# EAGLE design Qwiic_KX134 (EAGLE 9.6.2)
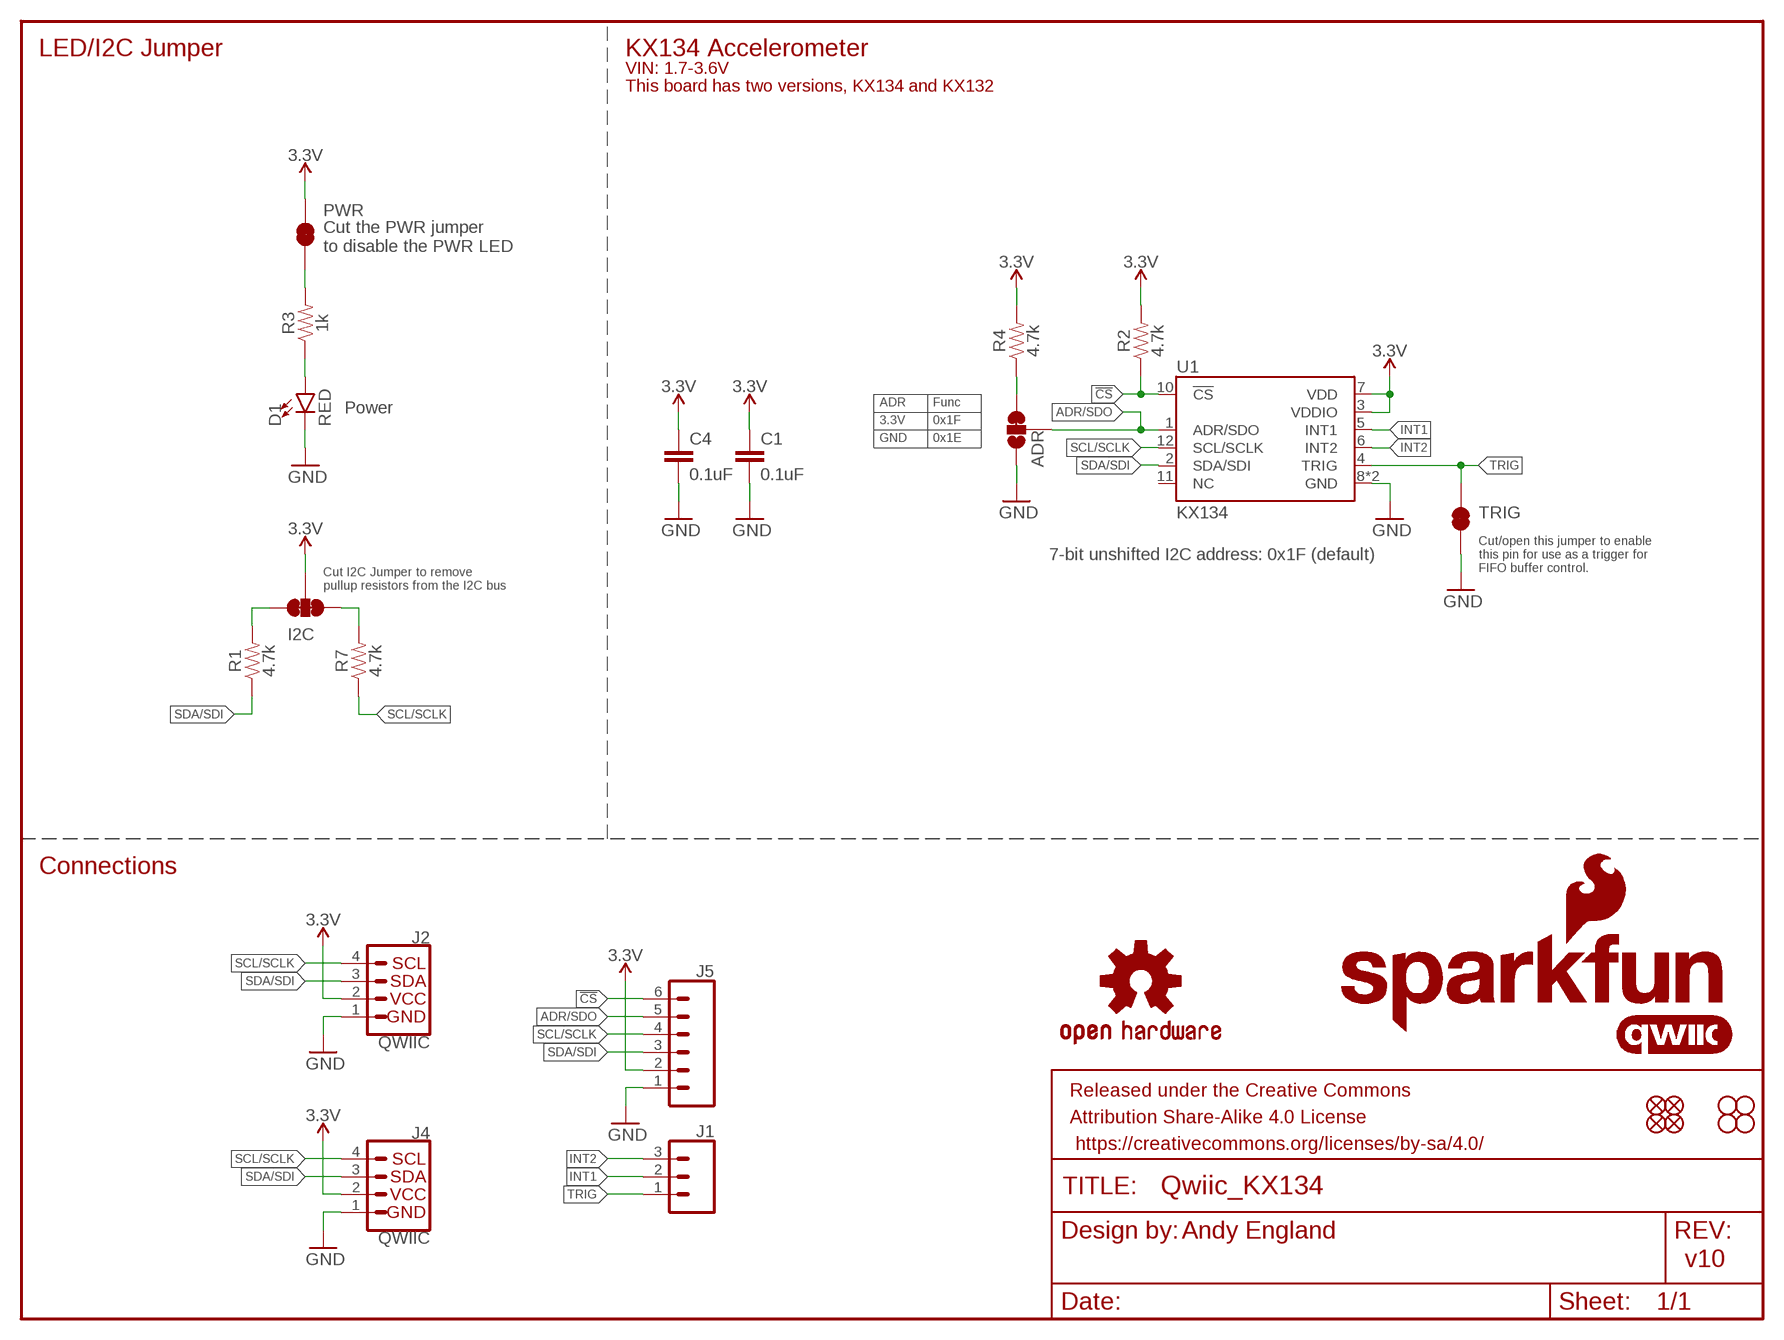
[diagram p0: schematic, sheet 1]

## Parts
ADR  JUMPER-SMT_3_1-NC_TRACE_SILK  [SMT-JUMPER_3_1-NC_TRACE_SILK]
C1  0.1uF  0.1UF-0603-25V-(+80/-20%)  [0603]
C4  0.1uF  0.1UF-0603-25V-(+80/-20%)  [0603]
D1  RED  LED-RED0603  [LED-0603]
FRAME1  FRAME-LETTER  [CREATIVE_COMMONS]
I2C  JUMPER-SMT_3_2-NC_TRACE_SILK  [SMT-JUMPER_3_2-NC_TRACE_SILK]
J1  CONN_031X03_NO_SILK  [1X03_NO_SILK]
J2  QWIIC  QWIIC_CONNECTORJS-1MM  [JST04_1MM_RA]
J4  QWIIC  QWIIC_CONNECTORJS-1MM  [JST04_1MM_RA]
J5  CONN_06NO_SILK_NO_POP  [1X06_NO_SILK]
JP1  FIDUCIALUFIDUCIAL  [MICRO-FIDUCIAL]
JP2  FIDUCIALUFIDUCIAL  [MICRO-FIDUCIAL]
JP3  STAND-OFF  [STAND-OFF]
JP4  STAND-OFF  [STAND-OFF]
JP5  FIDUCIALUFIDUCIAL  [MICRO-FIDUCIAL]
JP6  FIDUCIALUFIDUCIAL  [MICRO-FIDUCIAL]
JP7  STAND-OFF  [STAND-OFF]
JP8  STAND-OFF  [STAND-OFF]
LOGO1  SFE_LOGO_FLAME.1_INCH  [SFE_LOGO_FLAME_.1]
LOGO2  SFE_LOGO_FLAME.1_INCH  [SFE_LOGO_FLAME_.1]
LOGO3  QWIIC_LOGO_4MM  [QWIIC_4MM]
LOGO4  SFE_LOGO_NAME_FLAME.1_INCH  [SFE_LOGO_NAME_FLAME_.1]
LOGO5  OSHW-LOGOS  [OSHW-LOGO-S]
PWR  JUMPER-SMT_2_NC_TRACE_SILK  [SMT-JUMPER_2_NC_TRACE_SILK]
R1  4.7k  4.7KOHM-0603-1/10W-1%  [0603]
R2  4.7k  4.7KOHM-0603-1/10W-1%  [0603]
R3  1k  1KOHM-0603-1/10W-1%  [0603]
R4  4.7k  4.7KOHM-0603-1/10W-1%  [0603]
R7  4.7k  4.7KOHM-0603-1/10W-1%  [0603]
TRIG  JUMPER-SMT_2_NC_TRACE_SILK  [SMT-JUMPER_2_NC_TRACE_SILK]
U1  KX134  KX13X-KX134  [KX13X]

## Nets
3.3V: C1.1 C4.1 I2C.2 J2.2 J4.2 J5.2 PWR.2 R2.2 R4.2 U1.3(VDDIO) U1.7(VDD)
!CS: J5.6 R2.1 U1.10(!CS)
ADR/SDO: ADR.2 J5.5 U1.1(ADR/SDO)
GND: ADR.1 C1.2 C4.2 D1.C J2.1 J4.1 J5.1 TRIG.2 U1.8(GND) U1.9(GND)
INT1: J1.2 U1.5(INT1)
INT2: J1.3 U1.6(INT2)
N$1: PWR.1 R3.2
N$2: I2C.3 R1.2
N$3: D1.A R3.1
N$4: I2C.1 R7.2
N$5: ADR.3 R4.1
SCL/SCLK: J2.4 J4.4 J5.4 R7.1 U1.12(SCL/SCLK)
SDA/SDI: J2.3 J4.3 J5.3 R1.1 U1.2(SDA/SDI)
TRIG: J1.1 TRIG.1 U1.4(TRIG)
Unconnected: U1.11(NC)

## Notes on the sheet
- LED/I2C Jumper | KX134 Accelerometer
- VIN: 1.7-3.6V
- This board has two versions, KX134 and KX132
- Cut the PWR jumper 
  to disable the PWR LED
- ADR | Func
- Power
- 3.3V | 0x1F
- GND | 0x1E
- 7-bit unshifted I2C address: 0x1F (default)
- Cut/open this jumper to enable 
  this pin for use as a trigger for
  FIFO buffer control.
- Cut I2C Jumper to remove 
  pullup resistors from the I2C bus
- Connections
- Andy England
- v10

## Library data of the parts
ADR = SparkFun-Jumpers:JUMPER-SMT_3_1-NC_TRACE: Normally closed trace jumper (1 of 2 connections) This jumper has a trace between two pads so it's normally closed (NC). The other connection is normally open (NO). Use a razor knife to open the connection. For best results follow the IPC guidelines for cutting traces: Cutout at least 0.063 mm (0.005 in). Remove all loose material to clean up the cut area. Seal the cut with an approved epoxy. Reapply solder to reclose the connection, or to close the NO connection.
C1 C4 = SparkFun-Capacitors:0.1UF: 0.1µF ceramic capacitors A capacitor is a passive two-terminal electrical component used to store electrical energy temporarily in an electric field.; PROD_ID: CAP-00810
D1 = SparkFun-LED:LED-RED: Red SMD LED Used in manufacturing of most products at SparkFun Packages: 0603 - SMD 0603 package [Product Link] <http://docs.avagotech.com/docs/AV02-0551EN> 0603 SMART - SMD 0603 SMART package ( more efficient and expensive)[Product Link] <http://www.osram-os.com/Graphics/XPic2/00077099_0.pdf> 1206 - SMD1206 package [Product Link] <https://www.sparkfun.com/datasheets/DevTools/LilyPad/Q150OVS4.pdff> SparkFun Products: Pro Mini 328 -5V <https://www.sparkfun.com/products/821> RedBoard <https://www.sparkfun.com/products/12757> IOIO-OTG <https://www.sparkfun.com/products/13613>; PROD_ID: DIO-00819
FRAME1 = SparkFun-Aesthetics:FRAME-LETTER: Schematic Frame - Letter Standard 8.5x11 US Letter frame
I2C = SparkFun-Jumpers:JUMPER-SMT_3_2-NC_TRACE: Normally closed trace jumper (2 of 2 connections) This jumper has a trace between all three pads so they are normally closed (NC). Use a razor knife to open the connection(s). For best results follow the IPC guidelines for cutting traces: Cutout at least 0.063 mm (0.005 in). Remove all loose material to clean up the cut area. Seal the cut with an approved epoxy. Reapply solder to reclose the connection(s).
J1 = SparkFun-Connectors:CONN_03: Multi connection point. Often used as Generic Header-pin footprint for 0.1 inch spaced/style header connections On any of the 0.1 inch spaced packages, you can populate with these: Break Away Headers - Straight <https://www.sparkfun.com/products/116> (PRT-00116) Break Away Male Headers - Right Angle <https://www.sparkfun.com/products/553> (PRT-00553) Female Headers <https://www.sparkfun.com/products/115> (PRT-00115) Break Away Headers - Machine Pin <https://www.sparkfun.com/products/117> (PRT-00117) Break Away Female Headers - Swiss Machine Pin <https://www.sparkfun.com/products/743> (PRT-00743) Stackable Header - 3 Pin (Female, 0.1") <https://www.sparkfun.com/products/13875> (PRT-13875) For SCREWTERMINALS and SPRING TERMINALS visit here: Screw Terimnals on SparkFun.com <https://www.sparkfun.com/search/results?term=Screw+Terminals> (5mm/3.5mm/2.54mm spacing) This device is also useful as a general connection point to wire up your design to another part of your project. Our various solder wires solder well into these plated through hole pads. Hook-Up Wire - Assortment (Stranded, 22 AWG) <https://www.sparkfun.com/products/11375> (PRT-11375) Hook-Up Wire - Assortment (Solid Core, 22 AWG) <https://www.sparkfun.com/products/11367> (PRT-11367) View the entire wire category on our website here <https://www.sparkfun.com/categories/141> Special notes: Molex polarized connector foot print use with SKU : PRT-08232 with associated crimp pins and housings.
J2 J4 = SparkFun-Connectors:QWIIC_CONNECTOR: SparkFun I2C Standard Qwiic Connector An SMD 1mm pitch JST connector makes it easy and quick (get it? Qwiic?) to connect I2C devices to each other. The Qwiic system <http://www.sparkfun.com/qwiic> enables fast and solderless connection between popular platforms and various sensors and actuators. We carry 200mm <https://www.sparkfun.com/products/14204>, 100mm <https://www.sparkfun.com/products/14205>, 50mm <https://www.sparkfun.com/products/14206>, and breadboard friendly <https://www.sparkfun.com/products/14207> Qwiic cables. We also offer 10 pcs strips <https://www.sparkfun.com/products/14323> the SMD connectors.; PROD_ID: CONN-13694; VALUE: QWIIC_RIGHT_ANGLE
J5 = SparkFun-Connectors:CONN_06: Multi connection point. Often used as Generic Header-pin footprint for 0.1 inch spaced/style header connections On any of the 0.1 inch spaced packages, you can populate with these: Break Away Headers - Straight <https://www.sparkfun.com/products/116> (PRT-00116) Break Away Male Headers - Right Angle <https://www.sparkfun.com/products/553> (PRT-00553) Female Headers <https://www.sparkfun.com/products/115> (PRT-00115) Break Away Headers - Machine Pin <https://www.sparkfun.com/products/117> (PRT-00117) Break Away Female Headers - Swiss Machine Pin <https://www.sparkfun.com/products/743> (PRT-00743) Arduino Stackable Header - 6 Pin <https://www.sparkfun.com/products/9280> (PRT-09280) For SCREWTERMINALS and SPRING TERMINALS visit here: Screw Terimnals on SparkFun.com <https://www.sparkfun.com/search/results?term=Screw+Terminals> (5mm/3.5mm/2.54mm spacing) This device is also useful as a general connection point to wire up your design to another part of your project. Our various solder wires solder well into these plated through hole pads. Hook-Up Wire - Assortment (Stranded, 22 AWG) <https://www.sparkfun.com/products/11375> (PRT-11375) Hook-Up Wire - Assortment (Solid Core, 22 AWG) <https://www.sparkfun.com/products/11367> (PRT-11367) View the entire wire category on our website here <https://www.sparkfun.com/categories/141>
JP1 JP2 JP5 JP6 = SparkFun:FIDUCIAL: Fiducial Alignment Points Various fiducial points for machine vision alignment.
JP3 JP4 JP7 JP8 = SparkFun:STAND-OFF: Stand Off This is the mechanical footprint for a #4 phillips button head screw. Use the keepout ring to avoid running the screw head into surrounding components. SKU : PRT-00447
LOGO1 LOGO2 = SparkFun-Aesthetics:SFE_LOGO_FLAME: SparkFun Flame Logo This is the SparkFun flame logo. The logo on the schematic will always be the same size; the package variant is the height of the flame. Default layer for the logo on the board is tSilk.
LOGO3 = SparkFun-Aesthetics:QWIIC_LOGO: Qwiic Logos for placement on schematic and PCB. The 5.5mm silk logo is best for placing next to Qwiic connector.
LOGO4 = SparkFun-Aesthetics:SFE_LOGO_NAME_FLAME: SparkFun Font Logo w/ Flame This is the SparkFun full logo. The logo on the schematic will always be the same size; the package variant is the height of the flame part of the logo. Default layer for the logo on the board is tSilk.
LOGO5 = SparkFun-Aesthetics:OSHW-LOGO: Open-Source Hardware (OSHW) Logo This logo indicates the piece of hardware it is found on incorporates a OSHW license and/or adheres to the definition of open source hardware found here: http://freedomdefined.org/OSHW
PWR TRIG = SparkFun-Jumpers:JUMPER-SMT_2_NC_TRACE: Normally closed trace jumper This jumper has a trace between two pads so it's normally closed (NC). Use a razor knife to open the connection. For best results follow the IPC guidelines for cutting traces: Cutout at least 0.063 mm (0.005 in). Remove all loose material to clean up the cut area. Seal the cut with an approved epoxy. Reapply solder to reclose the connection.
R1 R2 R4 R7 = SparkFun-Resistors:4.7KOHM: 4.7kΩ resistor A resistor is a passive two-terminal electrical component that implements electrical resistance as a circuit element. Resistors act to reduce current flow, and, at the same time, act to lower voltage levels within circuits. - Wikipedia; PROD_ID: RES-07857
R3 = SparkFun-Resistors:1KOHM: 1kΩ resistor A resistor is a passive two-terminal electrical component that implements electrical resistance as a circuit element. Resistors act to reduce current flow, and, at the same time, act to lower voltage levels within circuits. - Wikipedia; PROD_ID: RES-07856
U1 = SparkFun-Sensors:KX13X: Kionix KX134 Tri-Axis Accelerometer The KX134-1211 is a tri-axis ±8g, ±16g, ±32g, or ±64g silicon micromachined accelerometer featuring a user-configurable 3-stage Advanced Data Path (ADP) consisting of a low-pass filter, low-pass/high-pass filter, and RMS calculation engine. The KX134-1211 accelerometer also features an advanced Wake-Up and Back-to-Sleep detection with a high-resolution threshold capability configurable down to 15.6 mg, 512-byte buffer that continues to record data even when being read, as well as embedded engines for orientation, Directional-TapTM/DoubleTapTM, and Free fall detection.; PROD_ID: IC-15486

## Net classes
1 power: width 0.203 mm

## Board
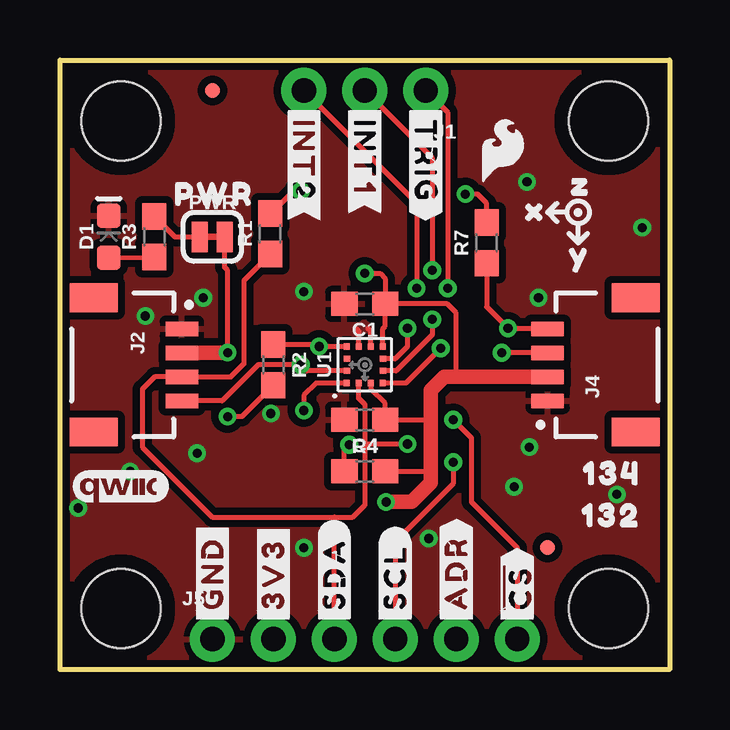
[diagram p1: board, top side]
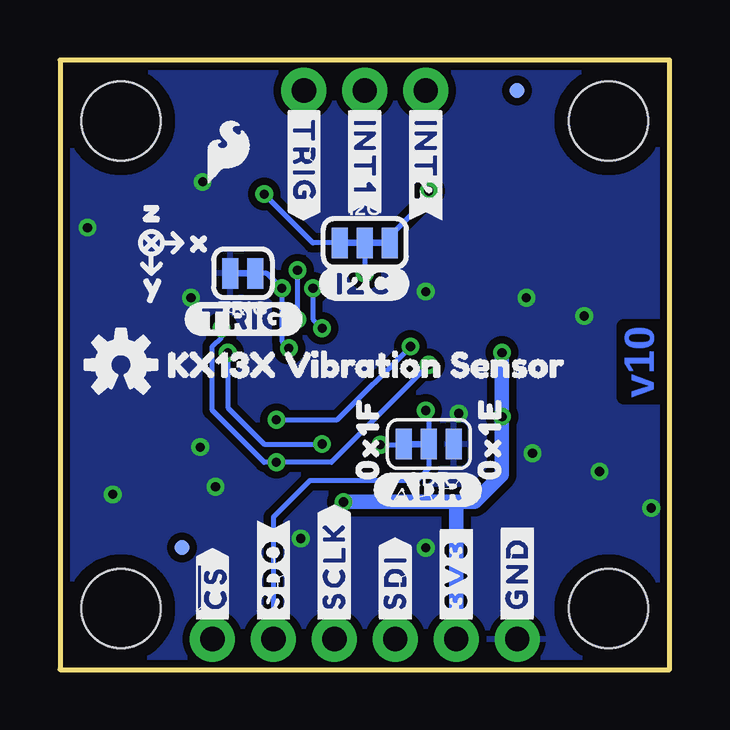
[diagram p2: board, bottom side, seen from below]

Size 25.4 x 25.4 mm. Coordinates in mm from the lower left corner, seen from the top.
Outline: 0,0 0,25.4 25.4,25.4 25.4,0 0,0
Copper layers (1*16): Top 0.035mm / dielectric 1.5mm / Bottom 0.035mm
Design rules "SparkFun-2-layer-TIGHT": minimum track width 7mil, minimum drill 15mil, track to track 7mil, track to pad 7mil, pad to pad 7mil, via to via 7mil, smd to smd 7mil, copper to edge 7mil, drill to drill 7mil, minimum pad ring 7mil, minimum via ring 7mil, stop-mask expansion 4mil, vias tented up to drill 25mil, thermal gap 10mil

### Footprints (pad centres in the part's own frame; a part is rotated, then mirrored left to right if it is on the bottom)
SMT-JUMPER_3_1-NC_TRACE_SILK = smd 0.66 x 1.27: 1 -1.041,0; 2 0,0; 3 1.041,0
0603 = smd 1.1 x 1: 1 -0.85,0; 2 0.85,0
LED-0603 = smd 1 x 1: A -0.877,0; C 0.877,0
SMT-JUMPER_3_2-NC_TRACE_SILK = smd 0.66 x 1.27: 1 -1.041,0; 2 0,0; 3 1.041,0
1X03_NO_SILK = drill 1.016 pad 1.88: 1 0,0; 2 2.54,0; 3 5.08,0
JST04_1MM_RA = smd 0.6 x 1.35: 1 -1.5,0; 2 -0.5,0; 3 0.5,0; 4 1.5,0 | smd 1.2 x 2: NC1 2.8,-3.675; NC2 -2.8,-3.675
1X06_NO_SILK = drill 1.016 pad 1.88: 1 0,0; 2 2.54,0; 3 5.08,0; 4 7.62,0; 5 10.16,0; 6 12.7,0
MICRO-FIDUCIAL = smd 0.635 x 0.635: 1 0,0
STAND-OFF = hole 3.302: 0,0
SMT-JUMPER_2_NC_TRACE_SILK = smd 0.66 x 1.27: 1 -0.521,0; 2 0.521,0
KX13X = smd 0.275 x 0.25: 1 -0.762,0.75; 2 -0.762,0.25; 3 -0.762,-0.25; 4 -0.762,-0.75; 7 0.762,-0.75; 8 0.762,-0.25; 9 0.762,0.25; 10 0.762,0.75 | smd 0.25 x 0.275: 5 -0.25,-0.75; 6 0.25,-0.75; 11 0.25,0.75; 12 -0.25,0.75

### Placement (x,y rotation side)
ADR  10.03,9.4 180 bottom
C1  12.7,15.24 180 top
C4  12.7,10.41 180 top
D1  2.03,18.03 90 top
FRAME1  -16.51,-7.62 0 top  (outside the outline)
I2C  12.7,17.78 0 bottom
J1  15.24,24.13 180 top
J2  5.08,12.7 270 top
J4  20.32,12.7 90 top
J5  6.35,1.27 0 top
JP1  6.35,24.13 0 bottom
JP2  20.32,5.08 0 top
JP3  2.54,22.86 0 top
JP4  22.86,22.86 0 top
JP5  20.32,5.08 0 bottom
JP6  6.35,24.13 0 top
JP7  2.54,2.54 0 top
JP8  22.86,2.54 0 top
LOGO1  18.44,21.64 0 top
LOGO2  18.39,21.59 0 bottom
LOGO3  2.54,7.62 0 top
LOGO4  -31.75,-15.24 0 top  (outside the outline)
LOGO5  22.86,12.7 0 bottom
PWR  6.35,18.03 0 top
R1  8.76,18.16 90 top
R2  8.89,12.7 270 top
R3  3.94,18.03 90 top
R4  12.7,8.26 0 top
R7  17.78,17.78 90 top
TRIG  17.78,16.51 180 bottom
U1  12.7,12.7 90 top
U$1  [X0]  20.68,17.86 0 bottom
U$2  [#SCL#0]  13.97,1.78 90 top
U$3  [#SDA#0]  11.43,1.78 90 top
U$4  [#3V3#0]  8.89,1.78 90 top
U$5  [#3V3#0]  8.89,1.78 90 bottom
U$6  [#GND#0]  6.35,1.78 90 top
U$7  [#GND#0]  6.35,1.78 90 bottom
U$8  [##CS##0]  19.05,1.78 90 top
U$9  [##CS##0]  19.05,1.78 90 bottom
U$10  [#ADR#0]  12.32,7.49 0 bottom
U$11  [#TRIG#0]  15.24,23.62 270 top
U$12  [#INT1#0]  12.7,23.62 270 top
U$13  [#INT1#0]  12.7,23.62 270 bottom
U$14  [0X1E0]  7.49,7.24 90 bottom
U$15  [#TRIG#0]  15.24,23.62 270 bottom
U$16  [KX13X_VIBRATION_SENSOR0]  21.84,12.7 0 bottom
U$17  [#TRIG#2]  20.19,14.61 0 bottom
U$18  [#INT2#0]  10.16,23.62 270 top
U$19  [#INT2#0]  10.16,23.62 270 bottom
U$20  [#ADR#3]  16.51,1.78 90 top
U$21  [Y0]  22.63,16.05 0 bottom
U$22  [#I2C#0]  14.61,16.08 0 bottom
U$23  [0X1F0]  12.57,7.24 90 bottom
U$24  [#SDI#0]  11.43,1.78 90 bottom
U$25  [#SCLK#0]  13.97,1.78 90 bottom
U$26  [#SDO#0]  16.51,1.78 90 bottom
U$28  [X0]  18.69,19.18 0 top
U$29  [Y0]  20.5,17.32 0 top
U$30  [Z0]  20.57,20.24 0 top
U$31  [PWR0]  4.06,19.81 0 top
U$32  [Z0]  22.66,19.13 0 bottom
U$33  [1320]  21.03,6.43 0 top
U$34  [1340]  21.08,8.18 0 top

### Tracks (layer width: path | path; a pad name or v marks a point on that pad's centre or on a via)
3.3V  (via drill 0.38)
  Top 0.203: J2.2 | PWR.2 6.86,18.02 6.86,16.76 6.99,16.64 v6.99,13.21 | U1.3 12.95,11.69 13.55,11.09 C4.1 15.46,10.41 | U1.7 13.45,14.21 13.55,14.31 C1.1 | 16.51,12.19 16.51,14.86 16.13,15.24 C1.1 | R2.2 7.58,10.54 v6.99,10.54 | R4.2 15.46,8.26 | v12.7,16.51 13.34,16.51 13.55,16.3 C1.1
  Top 0.61: J2.2 v6.99,13.21 | v13.59,6.99 14.66,6.99 15.46,7.78 15.46,8.26 15.46,10.41 15.46,11.65 16.01,12.2 16.52,12.2 | J4.2 16.52,12.2 | 16.51,12.19 16.52,12.2
  Bottom 0.203: I2C.2 v12.7,16.51
  Bottom 0.61: 8.89,6.99 8.13,6.99 6.99,8.13 v6.99,10.54 v6.99,13.21 | 8.89,6.99 J5.2 | 8.89,6.99 v13.59,6.99
!CS  (via drill 0.38)
  Top 0.203: R2.1 10.71,13.55 v10.79,13.46 U1.10 | v16.38,10.41 17.14,9.65 17.14,6.99 19.05,5.08 J5.6
  Bottom 0.203: v16.38,10.41 13.84,10.41 v10.79,13.46
ADR/SDO  (via drill 0.38)
  Top 0.203: U1.1 10.67,11.94 10.16,11.43 v10.16,10.79
  Bottom 0.203: v10.16,10.79 10.03,10.67 ADR.2 10.03,8.38 10.54,7.87 14.99,7.87 16.51,6.35 J5.5
GND  (via drill 0.38)
  Top 0.203: U1.8 12.95,14.1 12.83,14.22 | U1.9 12.45,14.09 12.32,14.22
  other vias: 10.16,15.75 23.2,7.3 3.56,14.73 5.97,15.49 15.37,5.46 18.92,7.62 19.56,9.27 24.26,18.41 19.94,15.49 2.92,8.26 8.79,10.67 5.71,9.02 0.76,6.73 19.46,20.32 10.16,5.08
  pour Bottom (isolate 0.305): 0,0 0,25.4 25.4,25.4 25.4,0
  pour Top (isolate 0.305): 0,0 0,25.4 25.4,25.4 25.4,0
INT1  (via drill 0.38)
  Top 0.203: J1.2 15.51,21.32 v15.51,16.64 | U1.5 14.01,12.45 15.51,13.95 v15.51,14.59
  Bottom 0.203: v15.51,16.64 v15.51,14.59
INT2  (via drill 0.38)
  Top 0.203: J1.3 14.86,19.43 v14.86,15.89 | v14.48,14.22 14.48,13.46 13.97,12.95 U1.6
  Bottom 0.203: v14.86,15.89 14.86,14.61 v14.48,14.22
N$1
  Top 0.203: R3.2 4.79,18.03 PWR.1
N$2  (via drill 0.38)
  Top 0.203: v10.03,19.94 9.73,19.94 8.8,19.01 R1.2
  Bottom 0.203: I2C.3 11.66,18.06 10.03,19.68 v10.03,19.94
N$3
  Top 0.178: R3.1 3.91,17.16 D1.A
N$4  (via drill 0.38)
  Top 0.203: v16.89,19.81 17.4,19.81 17.78,19.43 R7.2
  Bottom 0.203: I2C.1 14.86,17.78 v16.89,19.81
N$5  (via drill 0.38)
  Top 0.203: R4.1 11.85,9.17 v12.05,9.37
  Bottom 0.203: v12.05,9.37 11.1,9.37 ADR.3
SCL/SCLK  (via drill 0.38)
  Top 0.203: J4.4 20.3,14.22 v18.67,14.22 17.78,15.11 R7.1 | J2.4 6.75,11.2 8.26,12.7 v10.03,12.7 10.28,12.45 U1.12 | v16.38,8.64 16.38,7.75 13.97,5.33 J5.4
  Bottom 0.203: v10.03,12.7 14.1,8.64 v16.38,8.64 16.89,8.64 19.05,10.8 19.05,13.47 18.67,13.85 v18.67,14.22
SDA/SDI  (via drill 0.38)
  Top 0.203: R1.1 7.66,16.21 7.66,12.74 7.12,12.2 J2.3 3.94,12.2 3.43,11.68 3.43,9.27 6.35,6.35 11.43,6.35 | U1.2 12.45,11.3 12.7,11.05 12.7,9.4 | J4.3 v18.41,13.2 | 12.7,9.4 12.7,6.86 12.19,6.35 11.43,6.35 | J5.3 11.43,6.35 | v14.48,9.4 12.7,9.4
  Bottom 0.203: v18.41,13.2 18.41,10.91 16.89,9.4 v14.48,9.4
TRIG  (via drill 0.38)
  Top 0.203: J1.1 16.15,23.22 v16.15,15.89 | v15.86,13.39 14.41,11.94 U1.4
  Bottom 0.203: v15.86,13.39 16.15,13.68 v16.15,15.89 16.78,16.51 TRIG.1

### Text on the board
Bottom: v10
Measures: Dimensions in inches
tDocu: Andy England